# EAGLE design DorkBoard-a1 (EAGLE 5.00)
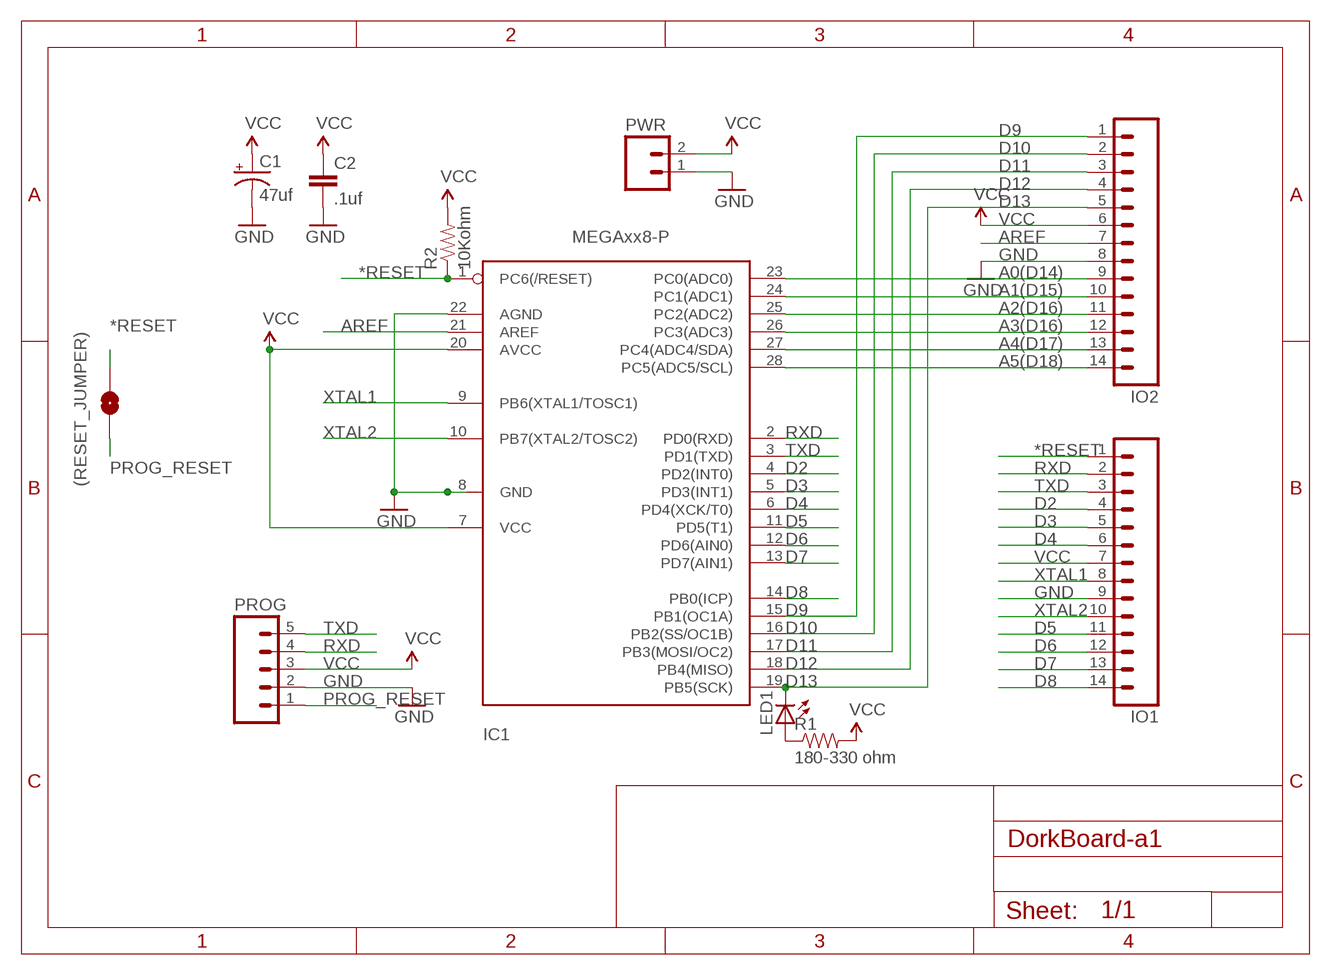
[diagram p0: schematic, sheet 1]

## Parts
(RESET_JUMPER)  SOLDERJUMPER  SOLDERJUMPERNC  [SJ-NC]
C1  47uf  CAP_POLPTH2  [CPOL-RADIAL-10UF-25V]
C2  .1uf  CAPPTH  [CAP-PTH-SMALL]
IC1  MEGAxx8-P  MEGA8-P  [DIL28-3]
IO1  M14  [1X14]
IO2  M14  [1X14]
LED1  LED3MM  [LED3MM]
PROG  M05  [1X05]
PWR  M02PTH  [1X02]
R1  180-330 ohm  RESISTOR1206  [1206]
R2  10Kohm  RESISTOR1206  [1206]

## Nets
*RESET: (RESET_JUMPER).1 IC1.1(PC6(/RESET)) IO1.1 R2.1
A0(D14): IC1.23(PC0(ADC0)) IO2.9
A1(D15): IC1.24(PC1(ADC1)) IO2.10
A2(D16): IC1.25(PC2(ADC2)) IO2.11
A3(D16): IC1.26(PC3(ADC3)) IO2.12
A4(D17): IC1.27(PC4(ADC4/SDA)) IO2.13
A5(D18): IC1.28(PC5(ADC5/SCL)) IO2.14
AREF: IC1.21(AREF) IO2.7
D2: IC1.4(PD2(INT0)) IO1.4
D3: IC1.5(PD3(INT1)) IO1.5
D4: IC1.6(PD4(XCK/T0)) IO1.6
D5: IC1.11(PD5(T1)) IO1.11
D6: IC1.12(PD6(AIN0)) IO1.12
D7: IC1.13(PD7(AIN1)) IO1.13
D8: IC1.14(PB0(ICP)) IO1.14
D9: IC1.15(PB1(OC1A)) IO2.1
D10: IC1.16(PB2(SS/OC1B)) IO2.2
D11: IC1.17(PB3(MOSI/OC2)) IO2.3
D12: IC1.18(PB4(MISO)) IO2.4
D13: IC1.19(PB5(SCK)) IO2.5 LED1.K(C)
GND: C1.2(-) C2.2 IC1.8(GND) IC1.22(AGND) IO1.9 IO2.8 PROG.2 PWR.1
N$29: LED1.A R1.1
PROG_RESET: (RESET_JUMPER).2 PROG.1
RXD: IC1.2(PD0(RXD)) IO1.2 PROG.4
TXD: IC1.3(PD1(TXD)) IO1.3 PROG.5
VCC: C1.1(+) C2.1 IC1.7(VCC) IC1.20(AVCC) IO1.7 IO2.6 PROG.3 PWR.2 R1.2 R2.2
XTAL1: IC1.9(PB6(XTAL1/TOSC1)) IO1.8
XTAL2: IC1.10(PB7(XTAL2/TOSC2)) IO1.10

## Library data of the parts
(RESET_JUMPER) = SparkFun:SOLDERJUMPER: Solder Jumper Standard SMD solder jumper. Used to automate production. Two varients : Normally Open and Normally Closed are the same, but have different paste layers. NC will have a large amount of paste and should jumper during reflow.
C1 = SparkFun:CAP_POL: Capacitor Polarized These are standard SMD and PTH capacitors. Normally 10uF, 47uF, and 100uF in electrolytic and tantalum varieties. Always verify the external diameter of the through hole cap, it varies with capacity, voltage, and manufacturer. The EIA devices should be standard.
C2 = SparkFun:CAP: Capacitor Standard 0603 ceramic capacitor, and 0.1" leaded capacitor.
IC1 = atmel:MEGA8-P: MICROCONTROLLER 8 Kbytes FLASH, 1 kbytes SRAM, 512 bytes EEPROM, USART, 4-channel 10 bit ADC, 2-channel 8 bit ADC Pin compatible with Atmega48, ATMega88, ATMega168 Source: avr.lbr
IO1 IO2 = SparkFun:M14: Header 14 Standard 14-pin 0.1" header. Use with straight break away headers (SKU : PRT-00116), right angle break away headers (PRT-00553), swiss pins (PRT-00743), machine pins (PRT-00117), and female headers (PRT-00115).
LED1 = SparkFun:LED: LEDs Standard schematic elements and footprints for 5mm, 3mm, 1206, and 0603 sized LEDs. 5mm - Spark Fun Electronics SKU : COM-00529 (and others)
PROG = SparkFun:M05: Header 5 Standard 5-pin 0.1" header. Use with straight break away headers (SKU : PRT-00116), right angle break away headers (PRT-00553), swiss pins (PRT-00743), machine pins (PRT-00117), and female headers (PRT-00115). Molex polarized connector foot print use with SKU : PRT-08230 with associated crimp pins and housings.
PWR = SparkFun:M02: Header 2 Standard 2-pin 0.1" header. Use with straight break away headers (SKU : PRT-00116), right angle break away headers (PRT-00553), swiss pins (PRT-00743), machine pins (PRT-00117), and female headers (PRT-00115). Molex polarized connector foot print use with SKU : PRT-08233 with associated crimp pins and housings.
R1 R2 = SparkFun:RESISTOR: Resistor Basic schematic elements and footprints for 0603, 1206, and PTH 1/10th watt (small) resistors.

## Board
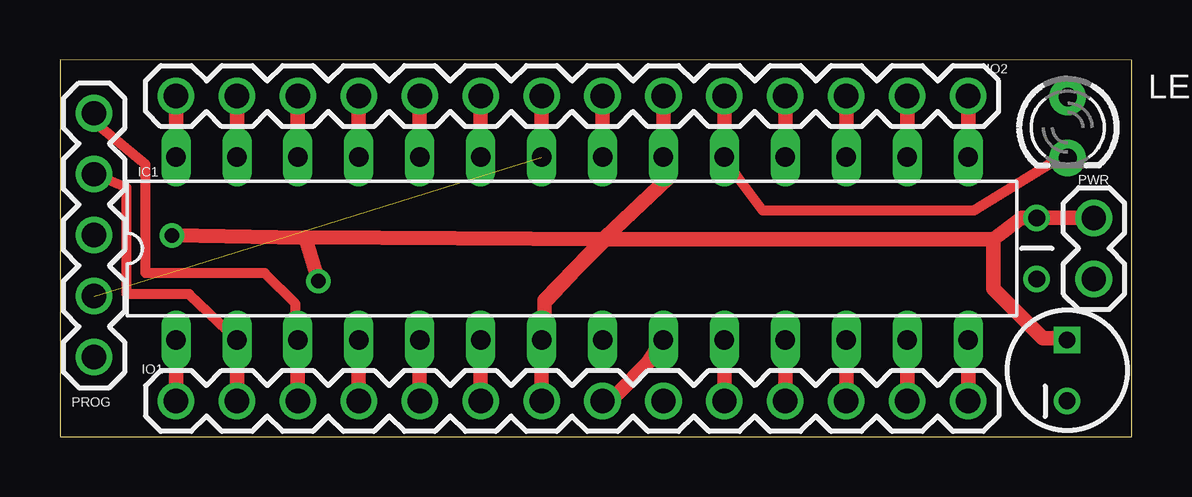
[diagram p1: board, top side]
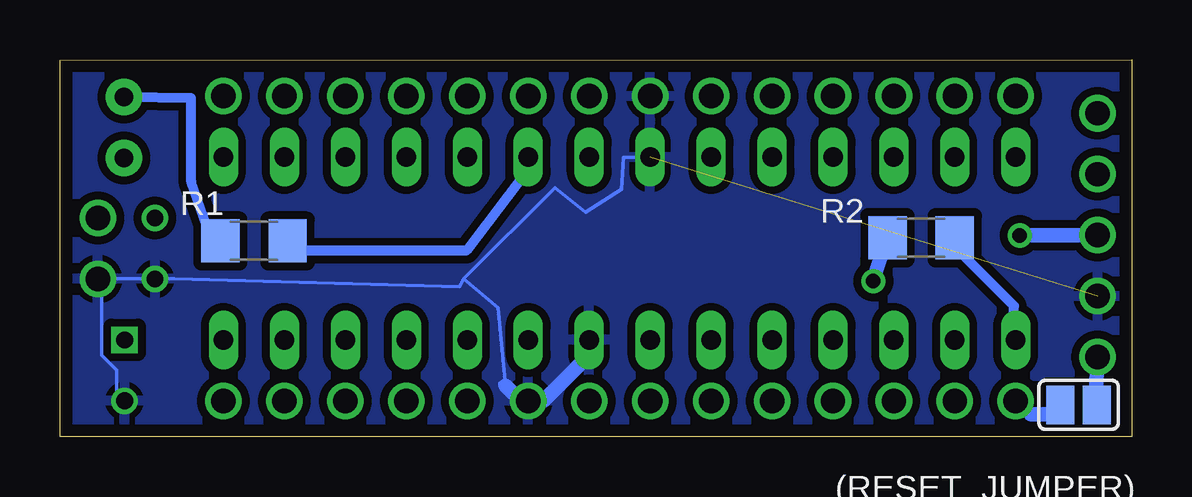
[diagram p2: board, bottom side, seen from below]

Size 44.68 x 15.71 mm. Coordinates in mm from the lower left corner, seen from the top.
Outline: 0,0 44.68,0 44.68,15.71 0,15.71 0,0
Copper layers (1*16): Top 0.0178mm / dielectric 1.4986mm / Bottom 0.0178mm
Design rules "SSC-EAGLE-2Lyr_v1.0.0.3": minimum track width 6mil, minimum drill 14mil, track to track 6mil, track to pad 6mil, pad to pad 6mil, via to via 6mil, smd to smd 6mil, copper to edge 20mil, drill to drill 16mil, minimum pad ring 8mil, minimum via ring 8mil, stop-mask expansion 3mil, vias tented up to drill 0mil, thermal gap 10mil

### Footprints (pad centres in the part's own frame; a part is rotated, then mirrored left to right if it is on the bottom)
SJ-NC = smd 1.168 x 1.6: 1 -0.762,0; 2 0.762,0
CPOL-RADIAL-10UF-25V = drill 0.7 square: 1 1.27,0 | drill 0.7 round: 2 -1.27,0
CAP-PTH-SMALL = drill 0.7 round: 1 0,0; 2 2.54,0
DIL28-3 = drill 0.813 long: 1 -16.51,-3.81; 2 -13.97,-3.81; 3 -11.43,-3.81; 4 -8.89,-3.81; 5 -6.35,-3.81; 6 -3.81,-3.81; 7 -1.27,-3.81; 8 1.27,-3.81; 9 3.81,-3.81; 10 6.35,-3.81; 11 8.89,-3.81; 12 11.43,-3.81; 13 13.97,-3.81; 14 16.51,-3.81; 15 16.51,3.81; 16 13.97,3.81; 17 11.43,3.81; 18 8.89,3.81; 19 6.35,3.81; 20 3.81,3.81; 21 1.27,3.81; 22 -1.27,3.81; 23 -3.81,3.81; 24 -6.35,3.81; 25 -8.89,3.81; 26 -11.43,3.81; 27 -13.97,3.81; 28 -16.51,3.81
1X14 = drill 1.016 round: 1 0,0; 2 2.54,0; 3 5.08,0; 4 7.62,0; 5 10.16,0; 6 12.7,0; 7 15.24,0; 8 17.78,0; 9 20.32,0; 10 22.86,0; 11 25.4,0; 12 27.94,0; 13 30.48,0; 14 33.02,0
LED3MM = drill 0.762 pad 1.524 round: A -1.27,0; K 1.27,0
1X05 = drill 1.016 round: 1 0,0; 2 2.54,0; 3 5.08,0; 4 7.62,0; 5 10.16,0
1X02 = drill 1.016 round: 1 0,0; 2 2.54,0
1206 = smd 1.6 x 1.8: 1 -1.4,0; 2 1.4,0

### Placement (x,y rotation side)
(RESET_JUMPER)  2.21,1.34 0 bottom
C1  41.98,2.77 90 top
C2  40.71,9.12 270 top
IC1  21.35,7.85 0 top
IO1  4.84,1.5 0 top
IO2  37.86,14.2 180 top
LED1  42.01,12.89 270 top
PROG  1.42,3.33 90 top
PWR  43.09,6.58 90 top
R1  36.59,8.17 0 bottom
R2  8.78,8.3 180 bottom

### Tracks (layer width: path | path; a pad name or v marks a point on that pad's centre or on a via)
*RESET
  Top 0.61: IO1.1 IC1.1
  Bottom 0.152: (RESET_JUMPER).1 3.33,0.95
  Bottom 0.406: IO1.1 | R2.1 7.38,7.93 4.91,5.46 4.91,4.12 IC1.1 | IC1.1 | IC1.1
  Bottom 0.61: 3.33,0.95 4.2,0.95 IO1.1
A0(D14)
  Top 0.61: IC1.23 IO2.9
A1(D15)
  Top 0.61: IC1.24 IO2.10
A2(D16)
  Top 0.61: IC1.25 IO2.11
A3(D16)
  Top 0.61: IC1.26 IO2.12
A4(D17)
  Top 0.61: IC1.27 IO2.13
A5(D18)
  Top 0.61: IC1.28 IO2.14
AREF
  Top 0.61: IC1.21 IO2.7
D2
  Top 0.61: IO1.4 IC1.4
D3
  Top 0.61: IO1.5 IC1.5
D4
  Top 0.61: IO1.6 IC1.6
D5
  Top 0.61: IO1.11 IC1.11
D6
  Top 0.61: IO1.12 IC1.12
D7
  Top 0.61: IO1.13 IC1.13
D8
  Top 0.61: IO1.14 IC1.14
D9
  Top 0.61: IC1.15 IO2.1
D10
  Top 0.61: IC1.16 IO2.2
D11
  Top 0.61: IC1.17 IO2.3
D12
  Top 0.61: IC1.18 IO2.4
D13
  Top 0.254: 41.59,11.59 LED1.K
  Top 0.406: 41.59,11.59 38.09,9.44 29.28,9.44 28.33,10.71 IC1.19
  Top 0.61: IC1.19 IO2.5
GND  (1 unrouted)
  Top 0.61: IC1.22 IO2.8
  Bottom 0.152: 24.52,1.5 IO1.9 | C1.2 42.3,1.82 42.3,2.77 42.94,3.41 42.94,5.95 PWR.1 C2.2 39.92,6.58 28.01,6.27 27.85,6.58 | 26.11,2.14 26.42,5.39 27.85,6.58 | 27.85,6.58 24.04,10.39 22.77,9.36 21.27,10.31 21.19,11.66 IC1.22
  Bottom 0.254: IO1.9 25.79,1.82 | 26.11,2.14 26.29,2.21
  Bottom 0.61: 25.79,1.82 26.11,2.14 | 24.52,1.5 22.93,3.09 IC1.8
  pour Bottom (isolate 0.33): 0.15,15.47 44.21,15.39 44.29,0.23 0.15,0.15
N$29
  Bottom 0.254: 38.57,8.81 38.49,8.81 R1.1 | LED1.A 42.06,14.12
  Bottom 0.406: 38.57,8.81 39.21,10.63 39.21,14.12 LED1.A
PROG_RESET
  Bottom 0.152: (RESET_JUMPER).2 1.42,1.5
  Bottom 0.61: 1.42,1.5 1.5,1.98 PROG.1
RXD
  Top 0.406: PROG.4 2.77,10.39 2.77,5.95 5.39,5.95 IC1.2
  Top 0.61: IO1.2 IC1.2
TXD
  Top 0.152: IC1.3 10.07,3.09 10.07,2.14 IO1.3
  Top 0.406: PROG.5 1.66,12.93 3.57,11.35 3.57,6.82 8.54,6.82 9.82,5.54 9.82,4.91 9.84,4.91 | IC1.3 9.84,4.91 | 9.84,4.91 9.84,5
  Top 0.61: IO1.3 IC1.3
VCC  (via drill 0.6)
  Top 0.61: IO1.7 IC1.7 20.12,4.04 20.2,4.12 20.2,5.7 | 41.75,9.12 C2.1 | 41.75,9.12 PWR.2 | 41.82,4.04 C1.1 41.92,4.12 40.96,4.12 38.9,6.18 38.9,8.24 | IO2.6 IC1.20 25.16,11.61 25.12,11.57 25.35,11.33 25.35,10.77 22.74,8.32 | 41.75,9.12 40.09,9.12 38.9,8.24 | 22.82,8.24 22.74,8.24 20.2,5.7 | 22.82,8.24 38.9,8.24 | 20.2,5.7 20.28,5.7 22.74,8.32 | v4.67,8.4 R2.2 10.2,8.3 10.22,8.32 | v4.67,8.4 | 10.22,8.32 v10.77,6.49 10.22,8.32 | 20.2,5.7 22.74,8.32 | 10.22,8.32 22.82,8.24
  Bottom 0.406: IC1.20 25.16,11.13 27.73,7.76 35.26,7.76 35.32,8.17 | 35.32,8.17 35.34,8.16 | 35.32,8.17 R1.2
  Bottom 0.61: v4.67,8.4 4.12,8.4 PROG.3 | R2.2 10.79,6.51 v10.77,6.49
XTAL1
  Top 0.61: IO1.8 23.25,1.82 24.52,3.09 IC1.9
XTAL2
  Top 0.61: IO1.10 IC1.10

### Text on the board
Document: Analog Inputs | Socket | 5 | 4 | 3 | 2 | 1 | 0 | GND | AREF | VCC | 13 | 12 | 11 | 10 | 9 | TXD | RXD | VCC | VCC | GND | GND | C1 | RESET | (4.7-100uf) | C2 | (.1uf) | (RESONATOR) | 8 | 0 | 1 | 2 | 3 | 4 | 5 | 6 | 7 | VCC | RESET